# EAGLE design Cargador_RasPi3HAT_CamSlot_v1.1 (EAGLE 9.3.0)
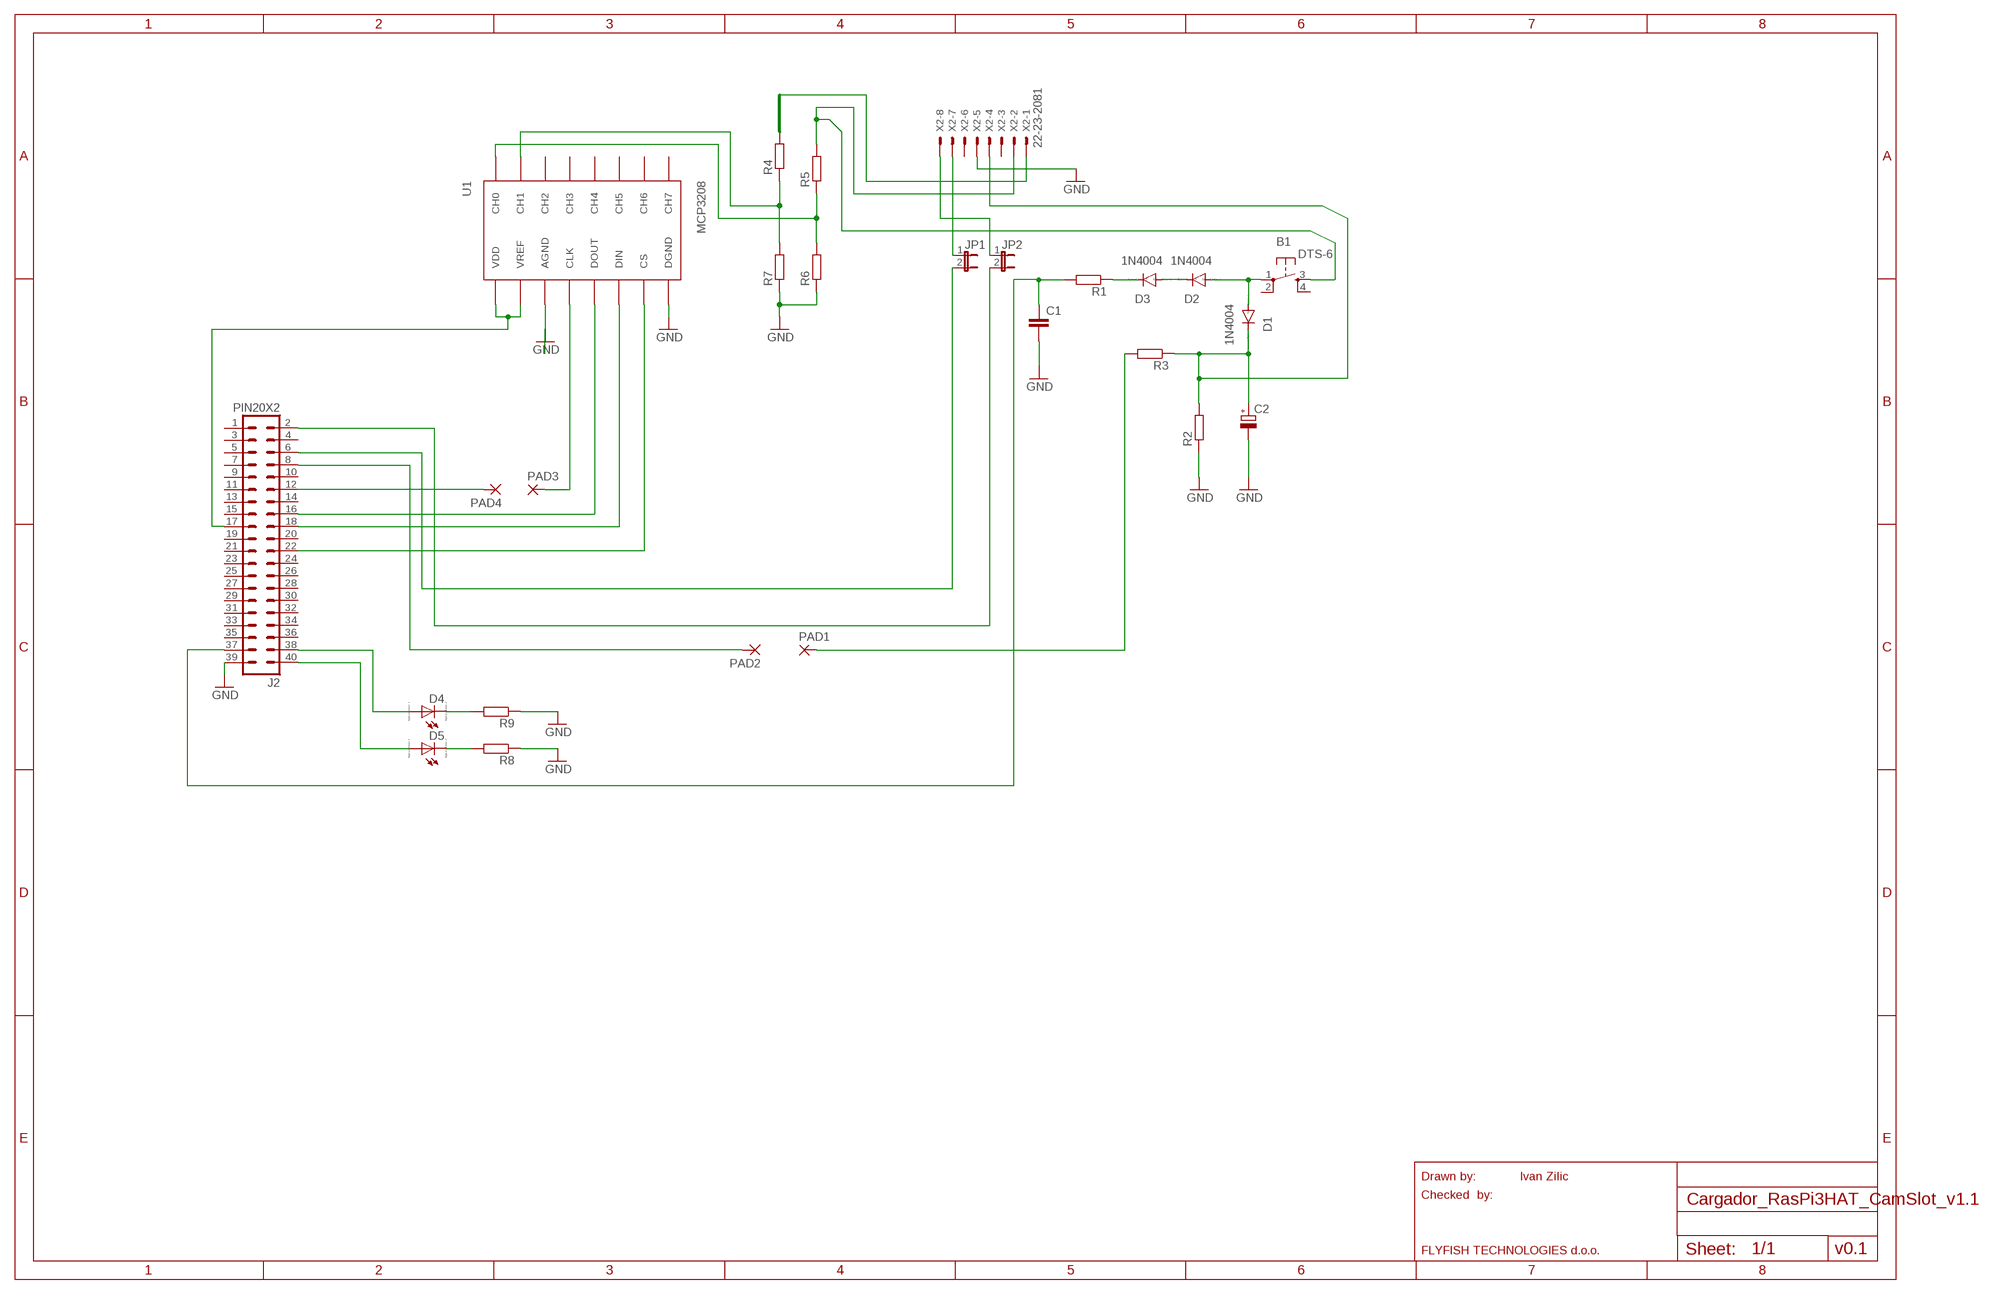
[diagram p0: schematic, sheet 1]

## Parts
B1  DTS-6  [DTS-6]
C1  C2.5/2  [C2.5-2]
C2  CPOL-EUE5-4  [E5-4]
D1  1N4004  [DO41-10]
D2  1N4004  [DO41-10]
D3  1N4004  [DO41-10]
D4  LED_ELD260  [LED_LD260]
D5  LED_ELD260  [LED_LD260]
J2  PIN20X2  [PIN_20X2]
JP1  JP1E  [JP1]
JP2  JP1E  [JP1]
PAD1  2,15/1,0  [2,15/1,0]
PAD2  2,15/1,0  [2,15/1,0]
PAD3  2,15/1,0  [2,15/1,0]
PAD4  2,15/1,0  [2,15/1,0]
R1  R-EU_0207/10  [0207/10]
R2  R-EU_0207/10  [0207/10]
R3  R-EU_0207/10  [0207/10]
R4  R-EU_0207/10  [0207/10]
R5  R-EU_0207/10  [0207/10]
R6  R-EU_0207/10  [0207/10]
R7  R-EU_0207/10  [0207/10]
R8  R-EU_0207/10  [0207/10]
R9  R-EU_0207/10  [0207/10]
U1  MCP3208  [DIL16]
X2  22-23-2081  [22-23-2081]

## Nets
GND [GND]: C1.2 C2.- J2.39 R2.1 R6.1 R7.1 R8.1 R9.1 U1.AGND U1.DGND X2.5
N$1: C1.1 J2.37 R1.2
N$2: J2.8 PAD2.1(P)
N$3: D4.K(C) R9.2
N$4: D5.K(C) R8.2
N$5: D3.C R1.1
N$6: D4.A J2.38
N$7: D5.A J2.40
N$8: J2.12 PAD4.1(P)
N$9: J2.16 U1.DOUT
N$10: J2.18 U1.DIN
N$11: PAD1.1(P) R3.2
N$12: J2.17 U1.VDD U1.VREF
N$13 [GND]: R4.1 R7.2 U1.CH1
N$14: R5.1 R6.2 U1.CH0
N$15: R4.2 X2.1
N$16 [GND]: B1.3 R5.2 X2.2
N$17: JP1.1 X2.7
N$18: J2.6 JP1.2
N$19: JP2.1 X2.8
N$20: PAD3.1(P) U1.CLK
N$21: J2.22 U1.CS
N$22: J2.2 JP2.2
N$23: D2.C D3.A
N$24 [GND]: B1.1 D1.A D2.A
N$26 [GND]: C2.+ D1.C R2.2 R3.1 X2.4
Unconnected: B1.2 B1.4 J2.1 J2.3 J2.4 J2.5 J2.7 J2.9 J2.10 J2.11 J2.13 J2.14 J2.15 J2.19 J2.20 J2.21 J2.23 J2.24 J2.25 J2.26 J2.27 J2.28 J2.29 J2.30 J2.31 J2.32 J2.33 J2.34 J2.35 J2.36 U1.CH2 U1.CH3 U1.CH4 U1.CH5 U1.CH6 U1.CH7 X2.3 X2.6

## Notes on the sheet
- Drawn by: | Ivan Zilic
- Checked  by:
- FLYFISH TECHNOLOGIES d.o.o. | v0.1

## Library data of the parts
B1 = switch-tact:DTS-6
C1 = capacitor-wima:C: CAPACITOR naming: grid - package width
C2 = rcl:CPOL-EU: POLARIZED CAPACITOR, European symbol; SPICEPREFIX: C
D1-D3 = diode:1N4004: DIODE general purpose rectifier, 1 A
D4 D5 = eagle-ltspice:LED_E: LED Source: http://www.osram.convergy.de Source: www.luxeon.com Source: www.kingbright.com; SPICEMODEL: NONE; SPICEPREFIX: D; SPICETYPE: diode
J2 = FLYFISH:PIN20X2
JP1 JP2 = jumper:JP1E: JUMPER
PAD1-PAD4 = wirepad:2,15/1,0: THROUGH-HOLE PAD
R1-R9 = rcl:R-EU_: RESISTOR, European symbol; SPICEPREFIX: R
U1 = mcp3208:MCP3208
X2 = con-molex:22-23-2081: .100" (2.54mm) Center Header - 8 Pin; MF: MOLEX; MPN: 22-23-2081; OC_FARNELL: 1756826; OC_NEWARK: 01C7592

## Net classes
1 GND: width 0.254 mm, clearance 0.381 mm

## Board
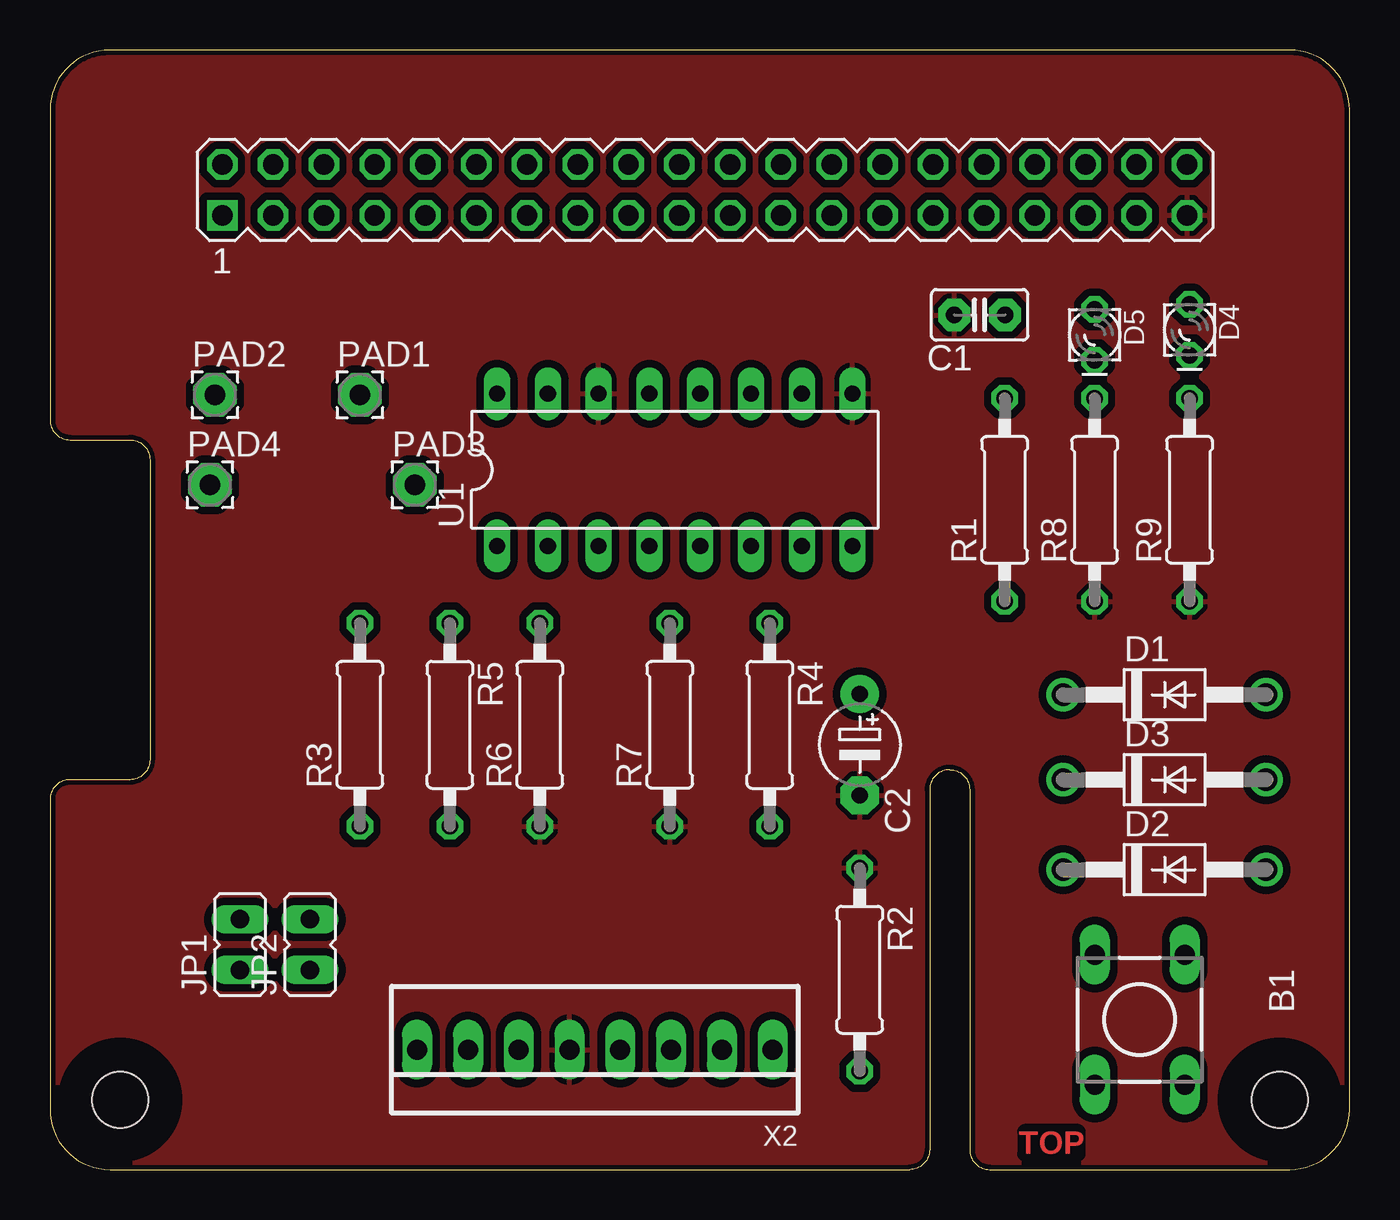
[diagram p1: board, top side]
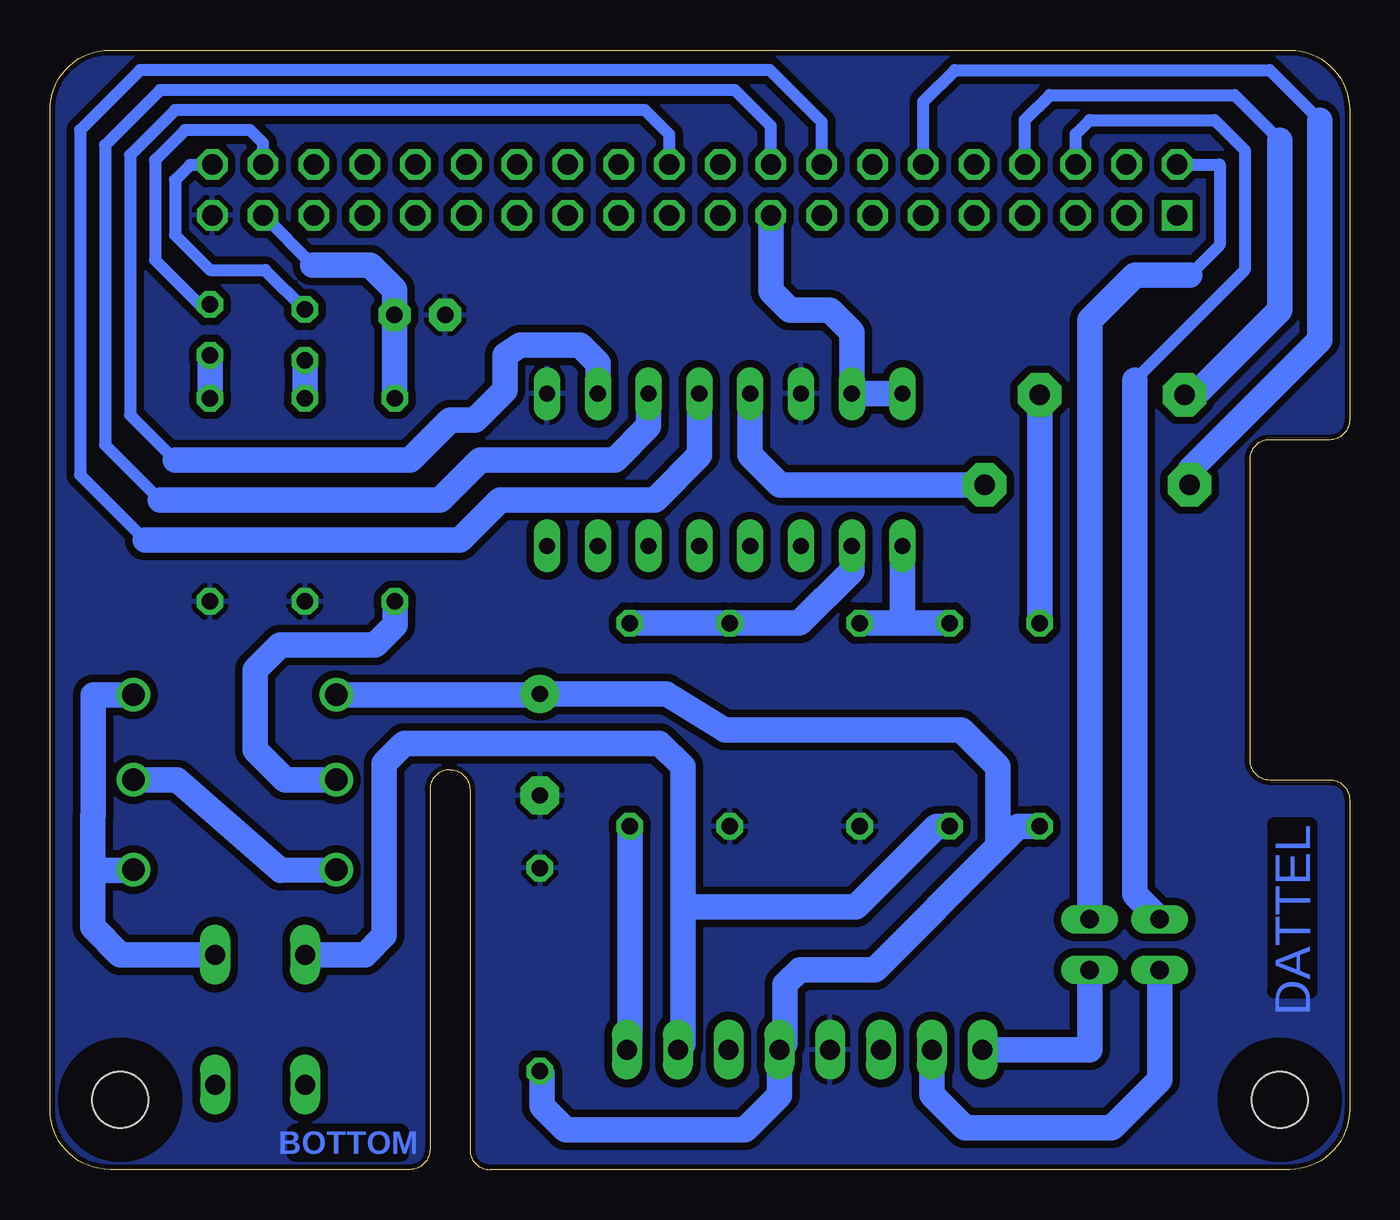
[diagram p2: board, bottom side, seen from below]

Size 65 x 56 mm. Coordinates in mm from the lower left corner, seen from the top.
Outline: 0,3 arc90 3,0 43,0 arc90 44,1 44,19 arc-90 45,20 arc-90 46,19 46,1 arc90 47,0 62,0 arc90 65,3 65,53 arc90 62,56 3,56 arc90 0,53 0,37.5 arc90 1,36.5 4,36.5 arc-90 5,35.5 5,20.5 arc-90 4,19.5 1,19.5 arc90 0,18.5 0,3
Copper layers (1*16): Top 0.035mm / dielectric 1.5mm / Bottom 0.035mm
Design rules "ITEADstudio_DRC": minimum track width 6mil, minimum drill 12mil, track to track 6mil, track to pad 6mil, pad to pad 6mil, via to via 6mil, smd to smd 0mil, copper to edge 10mil, drill to drill 10mil, minimum pad ring 10mil, minimum via ring 6mil, stop-mask expansion 2mil, vias tented up to drill 100mil, thermal gap 10mil
Holes 2.8 mm at 3.5,3.5 61.5,3.5
tRestrict: area 60,1.9 to 63,5; area 1.9,1.9 to 5,5
bRestrict: area 1.9,1.9 to 5,5; area 60,1.9 to 63,5

### Footprints (pad centres in the part's own frame; a part is rotated, then mirrored left to right if it is on the bottom)
DTS-6 = drill 1 long: 1 -3.25,2.25; 2 3.25,2.25; 3 -3.25,-2.25; 4 3.25,-2.25
C2.5-2 = drill 0.813 pad 1.6 octagon: 1 -1.27,0; 2 1.27,0
E5-4 = drill 0.813 pad 1.905: + -2.54,0 | drill 0.813 pad 1.905 octagon: - 2.54,0
DO41-10 = drill 1.118: A 5.08,0; C -5.08,0
LED_LD260 = drill 0.813 octagon: A -1.27,0; K 1.27,0
PIN_20X2 = drill 1.016 square: 1 -24.13,-1.27 | drill 1.016 octagon: 2 -24.13,1.27; 3 -21.59,-1.27; 4 -21.59,1.27; 5 -19.05,-1.27; 6 -19.05,1.27; 7 -16.51,-1.27; 8 -16.51,1.27; 9 -13.97,-1.27; 10 -13.97,1.27; 11 -11.43,-1.27; 12 -11.43,1.27; 13 -8.89,-1.27; 14 -8.89,1.27; 15 -6.35,-1.27; 16 -6.35,1.27; 17 -3.81,-1.27; 18 -3.81,1.27; 19 -1.27,-1.27; 20 -1.27,1.27; 21 1.27,-1.27; 22 1.27,1.27; 23 3.81,-1.27; 24 3.81,1.27; 25 6.35,-1.27; 26 6.35,1.27; 27 8.89,-1.27; 28 8.89,1.27; 29 11.43,-1.27; 30 11.43,1.27; 31 13.97,-1.27; 32 13.97,1.27; 33 16.51,-1.27; 34 16.51,1.27; 35 19.05,-1.27; 36 19.05,1.27; 37 21.59,-1.27; 38 21.59,1.27; 39 24.13,-1.27; 40 24.13,1.27
JP1 = drill 0.914 long: 1 0,-1.27; 2 0,1.27
2,15/1,0 = drill 1.016 pad 2.159 octagon: 1 0,0
0207/10 = drill 0.813 octagon: 1 -5.08,0; 2 5.08,0
DIL16 = drill 0.813 long: AGND -3.81,3.81; CH0 -8.89,-3.81; CH1 -6.35,-3.81; CH2 -3.81,-3.81; CH3 -1.27,-3.81; CH4 1.27,-3.81; CH5 3.81,-3.81; CH6 6.35,-3.81; CH7 8.89,-3.81; CLK -1.27,3.81; CS 6.35,3.81; DGND 8.89,3.81; DIN 3.81,3.81; DOUT 1.27,3.81; VDD -8.89,3.81; VREF -6.35,3.81
22-23-2081 = drill 1 long: 1 -8.89,0; 2 -6.35,0; 3 -3.81,0; 4 -1.27,0; 5 1.27,0; 6 3.81,0; 7 6.35,0; 8 8.89,0

### Placement (x,y rotation side)
B1  54.5,7.5 270 top
C1  46.5,42.75 180 top
C2  40.5,21.25 270 top
D1  55.75,23.75 0 top
D2  55.75,15 0 top
D3  55.75,19.5 0 top
D4  57,42 270 top
D5  52.25,41.75 270 top
J2  32.75,49 0 top
JP1  9.5,11.25 0 top
JP2  13,11.25 0 top
PAD1  15.5,38.75 0 top
PAD2  8.25,38.75 0 top
PAD3  18.25,34.25 0 top
PAD4  8,34.25 0 top
R1  47.75,33.5 90 top
R2  40.5,10 270 top
R3  15.5,22.25 90 top
R4  36,22.25 270 top
R5  20,22.25 270 top
R6  24.5,22.25 90 top
R7  31,22.25 90 top
R8  52.25,33.5 90 top
R9  57,33.5 90 top
U1  31.25,35 0 top
X2  27.25,6 180 top

### Tracks (layer width: path | path; a pad name or v marks a point on that pad's centre or on a via)
GND
  pour Bottom: 0,3 arc90 3,0 43,0 arc90 44,1 44,19 arc-90 45,20 arc-90 46,19 46,1 arc90 47,0 62,0 arc90 65,3 65,53 arc90 62,56 3,56 arc90 0,53 0,37.5 arc90 1,36.5 4,36.5 arc-90 5,35.5 5,20.5 arc-90 4,19.5 1,19.5 arc90 0,18.5
  pour Top: 0,3 arc90 3,0 43,0 arc90 44,1 44,19 arc-90 45,20 arc-90 46,19 46,1 arc90 47,0 62,0 arc90 65,3 65,53 arc90 62,56 3,56 arc90 0,53 0,37.5 arc90 1,36.5 4,36.5 arc-90 5,35.5 5,20.5 arc-90 4,19.5 1,19.5 arc90 0,18.5
  pour Bottom: 0.5,56.75 63.75,56.75 66,54.5 66,1.5 63.75,-0.75 1.5,-0.75 -0.75,1.5 -0.75,55.5
N$1
  Bottom 0.254: 47.77,38.6 R1.2
  Bottom 0.61: J2.37 51.86,45.25
  Bottom 1.27: 51.86,45.25 49,45.25 47.77,44.02 C1.1 47.77,38.6
N$2
  Bottom 0.61: J2.8 16.24,52.51 15,53.75 5.75,53.75 3.5,51.5
  Bottom 1.27: 3.5,51.5 3.5,43 7.75,38.75 PAD2.1
N$3
  Bottom 1.27: D4.K R9.2
N$4
  Bottom 1.27: R8.2 D5.K
N$5
  Bottom 1.27: R1.1 47.75,27.25 48.75,26.25 53.5,26.25 54.75,25 54.75,21 53.25,19.5 D3.C
N$6
  Bottom 0.61: J2.38 54.34,51.34 55,52 58.25,52 59.75,50.5 59.75,45.5 57.52,43.27 D4.A
N$7
  Bottom 0.254: J2.40 56.9,50.25
  Bottom 0.61: 56.9,50.25 58,50.25 58.75,49.5 58.75,46.75 57,45 54.23,45 D5.A
N$8
  Bottom 0.61: J2.12 21.32,53.43 19.75,55 4,55 1.5,52.5
  Bottom 1.27: 1.5,52.5 1.5,41.5 8,35 PAD4.1
N$9
  Bottom 0.61: J2.16 26.4,52.4 29,55 60.5,55 63.5,52 63.5,34.75 60.25,31.5
  Bottom 1.27: 60.25,31.5 44.5,31.5 42.5,33.5 34.75,33.5 32.52,35.73 U1.DOUT
N$10
  Bottom 0.61: J2.18 28.94,52.19 30.75,54 59.5,54 62.25,51.25 62.25,36.25 59.5,33.5
  Bottom 1.27: 59.5,33.5 45.5,33.5 43.5,35.5 36.75,35.5 35.06,37.19 U1.DIN
N$11
  Bottom 1.27: PAD1.1 R3.2
N$12
  Bottom 1.27: U1.VDD U1.VREF 24.9,41.9 26,43 28,43 28.94,43.94 J2.17
N$13
  Bottom 1.27: U1.CH1 24.9,29.94 27.51,27.33 R7.2 R4.1
N$14
  Bottom 1.27: U1.CH0 22.36,27.33 | 22.36,27.33 R6.2 | R5.1 22.36,27.33
N$15
  Bottom 0.254: 36,6.14 X2.1
  Bottom 1.27: R4.2 36,6.14
N$16
  Bottom 1.27: 33.34,13.14 24.68,13.14 20.65,17.17 R5.2 | 33.34,13.14 33.34,20.15 34.51,21.32 47.28,21.32 48.29,20.31 48.29,11.71 49.25,10.75 B1.3 | 33.34,13.14 33.34,6.25 X2.2
N$17
  Bottom 1.27: X2.7 20.9,3.75 19.23,2.08 11.9,2.08 9.5,4.48 JP1.1
N$18
  Bottom 0.61: J2.6 13.7,51.8 13,52.5 6.75,52.5 5.25,51 5.25,45 10.75,39.5
  Bottom 1.27: 10.75,39.5 10.75,13.77 JP1.2
N$19
  Bottom 1.27: JP2.1 13,6 X2.8
N$20
  Bottom 0.254: 30,38.79 U1.CLK
  Bottom 1.27: PAD3.1 28.5,34.25 30,35.75 30,38.79
N$21
  Bottom 0.61: J2.22 34.02,51.77 35.25,53 58.75,53 61,50.75 61,37.75 58.75,35.5
  Bottom 1.27: 58.75,35.5 47,35.5 45,37.5 43.75,37.5 42.25,39 42.25,40.75 41.5,41.25 38.5,41.25 37.6,40.35 U1.CS
N$22
  Bottom 0.61: J2.2 6.5,50.27 6.5,46.25 8,44.75
  Bottom 1.27: 8,44.75 10.75,44.75 13,42.5 JP2.2
N$23
  Bottom 1.27: D3.A 58.63,19.5 53.45,14.97 D2.C
N$24
  Bottom 0.254: 62.83,17.72 62.86,17.69
  Bottom 1.27: 62.86,14.97 62.86,12.14 61.48,10.75 B1.1 | D1.A 62.83,23.75 62.83,17.72 | D2.A 60.86,14.97 62.86,14.97 | 62.86,17.69 62.86,14.97
N$26
  Bottom 0.254: 40.54,23.75 C2.+
  Bottom 1.27: R2.2 40.4,4.82 40.4,3.17 39.23,2 30.23,2 28.52,3.71 X2.4 28.24,6.28 28.24,9.26 27.5,10 23.75,10 17.58,16.17 | 17.58,16.17 16.58,17.17 R3.1 | C2.+ 34.17,23.79 31.25,22 19.41,22 17.58,20.17 17.58,16.17 | D1.C 40.54,23.75

### Text on the board
Top: TOP
Bottom: DATTEL | BOTTOM